# EAGLE design QColor-V1 (EAGLE 6.0)
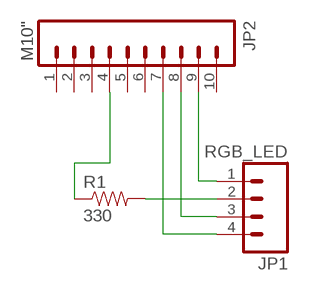
[diagram p0: schematic, sheet 1]

## Parts
JP1  RGB_LED  M04PTH  [1X04]
JP2  M10"  [1X10]
R1  330  RESISTORAXIAL-0.3  [AXIAL-0.3]

## Nets
N$1: JP2.4 R1.P$1
N$2: JP1.2 R1.P$2
N$3: JP1.1 JP2.9
N$4: JP1.3 JP2.8
N$5: JP1.4 JP2.7
Unconnected: JP2.1 JP2.2 JP2.3 JP2.5 JP2.6 JP2.10

## Library data of the parts
JP1 = SFE Connectors:M04: Header 4 Standard 4-pin 0.1" header. Use with straight break away headers (SKU : PRT-00116), right angle break away headers (PRT-00553), swiss pins (PRT-00743), machine pins (PRT-00117), and female headers (PRT-00115). Molex polarized connector foot print use with SKU : PRT-08231 with associated crimp pins and housings. 1MM SMD Version SKU: PRT-10208
JP2 = SFE Connectors:M10: Header 10 Standard 10-pin 0.1" header. Use with straight break away headers (SKU : PRT-00116), right angle break away headers (PRT-00553), swiss pins (PRT-00743), machine pins (PRT-00117), and female headers (PRT-00115).
R1 = SFE Passives:RESISTOR: Resistor Basic schematic elements and footprints for 0603, 1206, and PTH resistors.

## Board
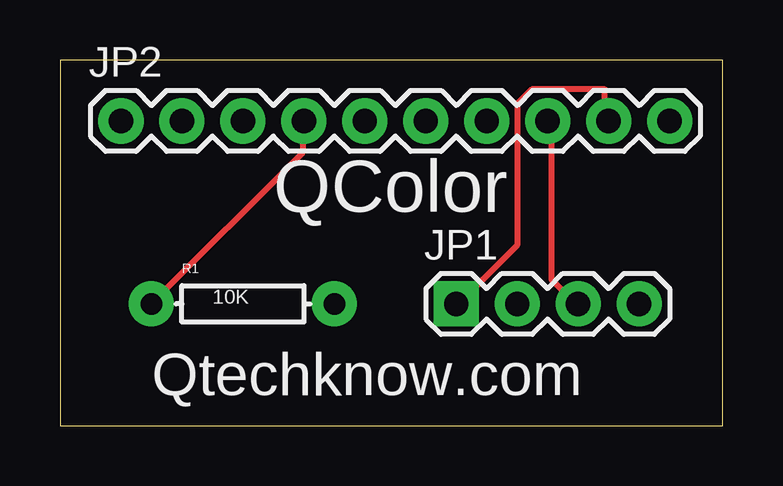
[diagram p1: board, top side]
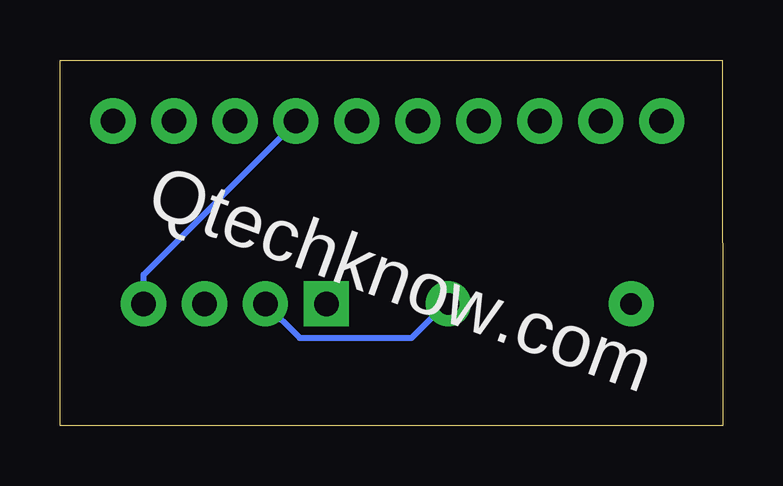
[diagram p2: board, bottom side, seen from below]

Size 27.61 x 15.24 mm. Coordinates in mm from the lower left corner, seen from the top.
Outline: 0,0 27.61,0 27.61,15.23 0.01,15.24 0,0
Copper layers (1*16): Top 0.035mm / dielectric 1.5mm / Bottom 0.035mm
Design rules: minimum track width 10mil, minimum drill 24mil, track to track 8mil, track to pad 8mil, pad to pad 8mil, via to via 8mil, smd to smd 8mil, copper to edge 40mil, drill to drill 8mil, minimum pad ring 10mil, minimum via ring 8mil, stop-mask expansion 4mil, vias tented up to drill 0mil, thermal gap 10mil

### Footprints (pad centres in the part's own frame; a part is rotated, then mirrored left to right if it is on the bottom)
1X04 = drill 1.016 pad 1.88 square: 1 0,0 | drill 1.016 pad 1.88: 2 2.54,0; 3 5.08,0; 4 7.62,0
1X10 = drill 1.016 pad 1.88: 1 0,0; 2 2.54,0; 3 5.08,0; 4 7.62,0; 5 10.16,0; 6 12.7,0; 7 15.24,0; 8 17.78,0; 9 20.32,0; 10 22.86,0
AXIAL-0.3 = drill 0.9 pad 1.88: P$1 -3.81,0; P$2 3.81,0

### Placement (x,y rotation side)
JP1  [1X04]  16.51,5.08 0 top
JP2  2.54,12.7 0 top
R1  [AXIAL-0.3]  7.62,5.08 0 top

### Tracks (layer width: path | path; a pad name or v marks a point on that pad's centre or on a via)
N$1
  Top 0.254: R1.P$1 10.11,11.38 10.11,12.6 JP2.4
N$2
  Bottom 0.254: JP1.2 17.63,3.66 12.95,3.66 11.53,5.08 R1.P$2
N$3
  Top 0.254: JP1.1 16.61,5.08 19.05,7.52 19.05,13.41 19.66,14.02 22.71,14.02 22.71,12.8 JP2.9
N$4
  Top 0.254: JP1.3 21.49,5.08 20.47,6.1 20.47,12.6 JP2.8
N$5
  Bottom 0.254: JP1.4 24.13,6.3 17.83,12.6 JP2.7

### Text on the board
tPlace: QColor | 10K | Qtechknow.com
bPlace: Qtechknow.com